# EAGLE design mega_meco_rev3 (EAGLE 9.0.1)
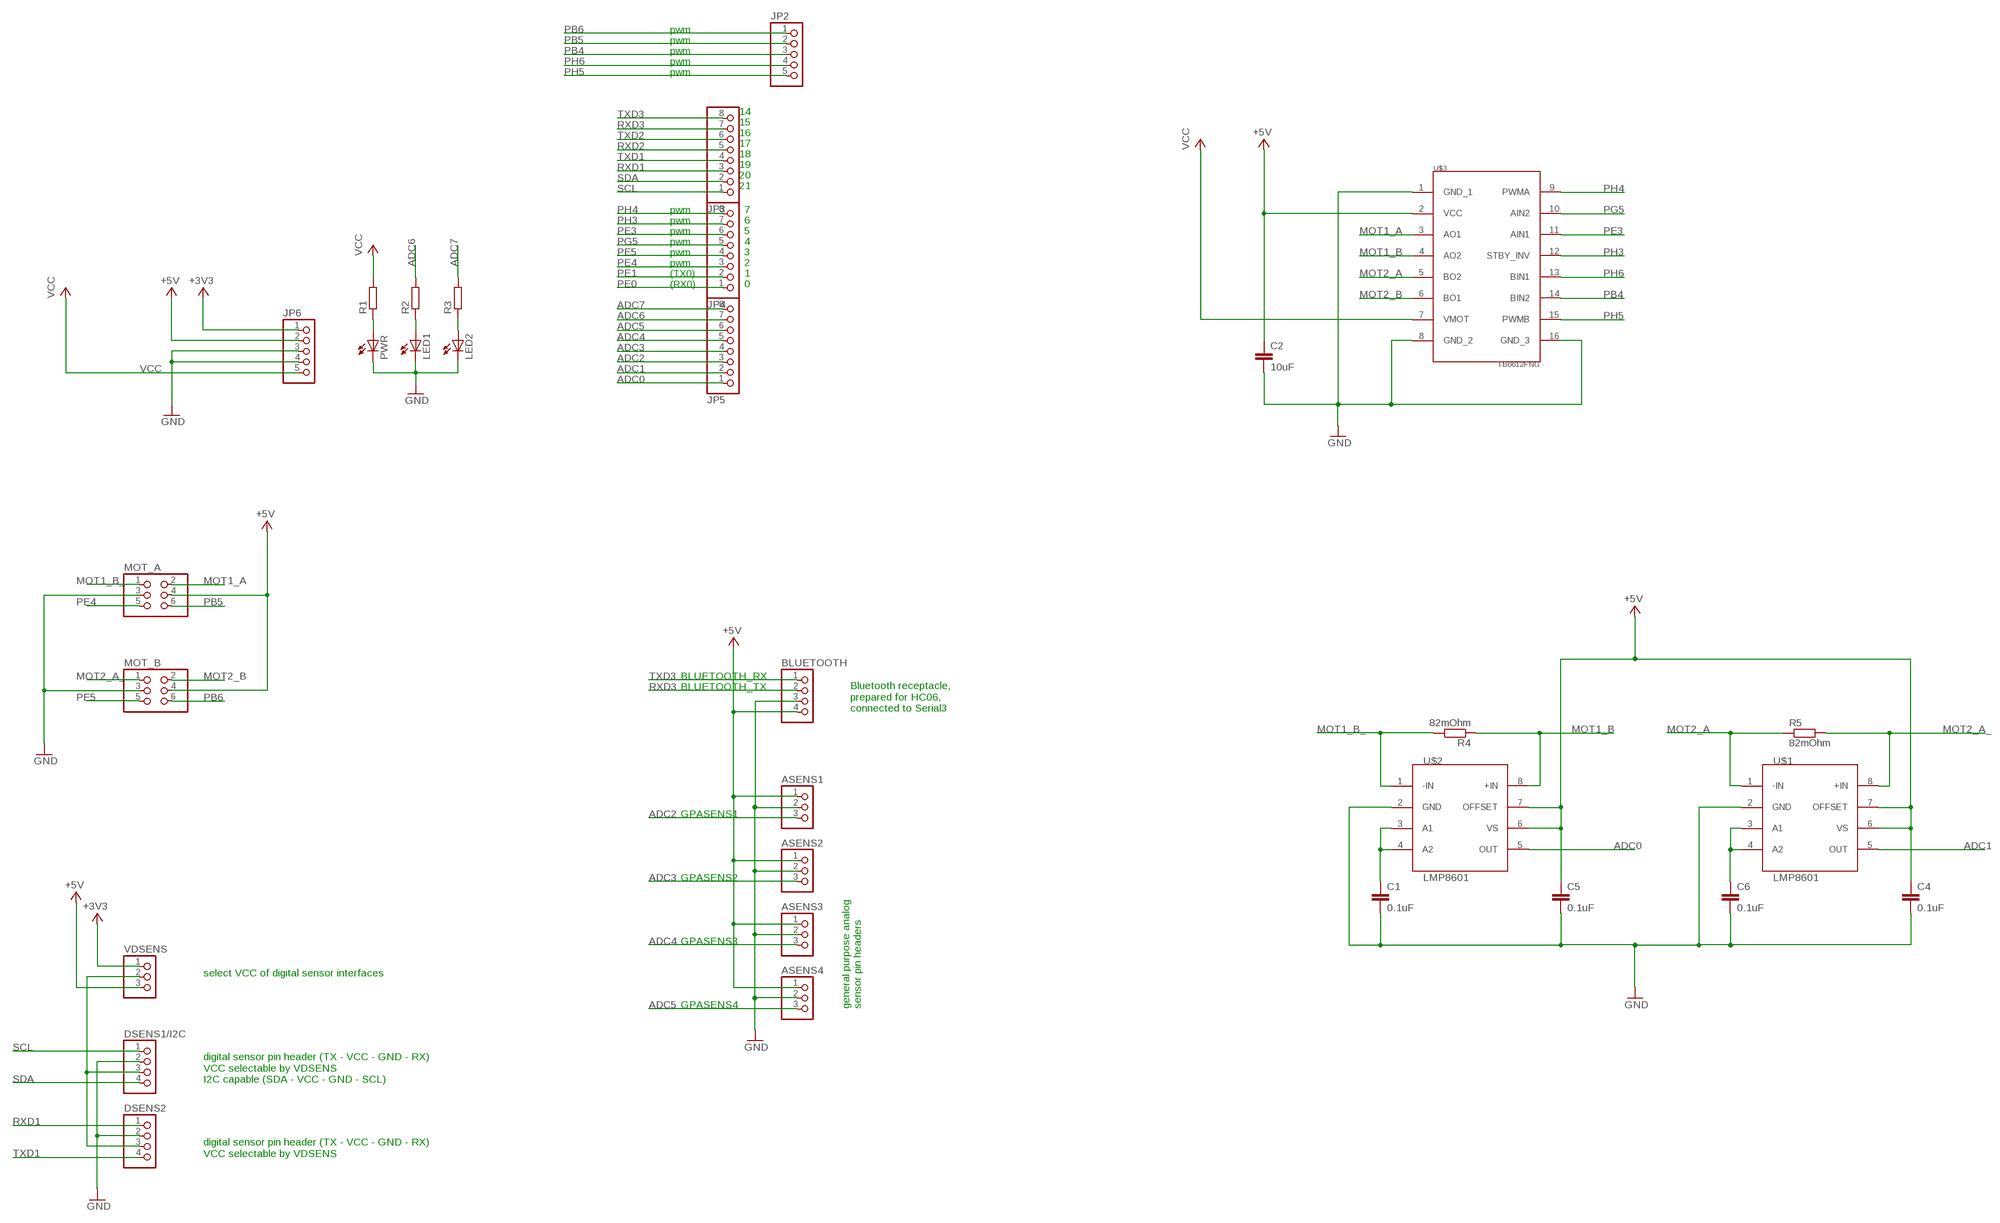
[diagram p0: schematic, sheet 1]

## Parts
ASENS1  PINHD-1X3  [1X03]
ASENS2  PINHD-1X3  [1X03]
ASENS3  PINHD-1X3  [1X03]
ASENS4  PINHD-1X3  [1X03]
BLUETOOTH  PINHD-1X4  [1X04]
C1  0.1uF  C-EUC0805  [C0805]
C2  10uF  C-EUC1206  [C1206]
C4  0.1uF  C-EUC0805  [C0805]
C5  0.1uF  C-EUC0805  [C0805]
C6  0.1uF  C-EUC0805  [C0805]
DSENS1/I2C  PINHD-1X4  [1X04]
DSENS2  PINHD-1X4  [1X04]
JP2  PINHD-1X5  [1X05]
JP3  PINHD-1X8  [1X08]
JP4  PINHD-1X8  [1X08]
JP5  PINHD-1X8  [1X08]
JP6  PINHD-1X5  [1X05]
LED1  LED3MM  [LED3MM]
LED2  LED3MM  [LED3MM]
MOT_A  PINHD-2X3  [2X03]
MOT_B  PINHD-2X3  [2X03]
PWR  LED5MM  [LED5MM]
R1  R-EU_R0805  [R0805]
R2  R-EU_R0805  [R0805]
R3  R-EU_R0805  [R0805]
R4  82mOhm  R-EU_R1206  [R1206]
R5  82mOhm  R-EU_R1206  [R1206]
U$1  LMP8601  [SOIC127P600X175-8N]
U$2  LMP8601  [SOIC127P600X175-8N]
U$3  TB6612FNG  [TB6612FNG_CARRIER]
VDSENS  PINHD-1X3  [1X03]

## Nets
+3V3 [power]: JP6.1 VDSENS.1
+5V [power usb]: ASENS1.1 ASENS2.1 ASENS3.1 ASENS4.1 BLUETOOTH.4 C2.1 C4.1 C5.1 JP6.2 MOT_A.4 MOT_B.4 U$1.6(VS) U$1.7(OFFSET) U$2.6(VS) U$2.7(OFFSET) U$3.2(VCC) VDSENS.3
ADC0: JP5.1 U$2.5(OUT)
ADC1: JP5.2 U$1.5(OUT)
ADC2: ASENS1.3 JP5.3
ADC3: ASENS2.3 JP5.4
ADC4: ASENS3.3 JP5.5
ADC5: ASENS4.3 JP5.6
ADC6: JP5.7 R2.2
ADC7: JP5.8 R3.2
GND [gnd]: ASENS1.2 ASENS2.2 ASENS3.2 ASENS4.2 BLUETOOTH.3 C1.2 C2.2 C4.2 C5.2 C6.2 DSENS1/I2C.2 DSENS2.2 JP6.3 JP6.4 LED1.K(C) LED2.K(C) MOT_A.3 MOT_B.3 PWR.K(C) U$1.2(GND) U$2.2(GND) U$3.1(GND_1) U$3.8(GND_2) U$3.16(GND_3)
MOT1_A: MOT_A.2 U$3.3(AO1)
MOT1_B: R4.1 U$2.8(+IN) U$3.4(AO2)
MOT1_B_: MOT_A.1 R4.2 U$2.1(-IN)
MOT2_A: R5.1 U$1.1(-IN) U$3.5(BO2)
MOT2_A_: MOT_B.1 R5.2 U$1.8(+IN)
MOT2_B: MOT_B.2 U$3.6(BO1)
N$1: PWR.A R1.1
N$2: LED1.A R2.1
N$3: C1.1 U$2.3(A1) U$2.4(A2)
N$4: C6.1 U$1.3(A1) U$1.4(A2)
N$5: DSENS1/I2C.3 DSENS2.3 VDSENS.2
N$6: LED2.A R3.1
PB4: JP2.3 U$3.14(BIN2)
PB5: JP2.2 MOT_A.6
PB6: JP2.1 MOT_B.6
PE0: JP4.1
PE1: JP4.2
PE3: JP4.6 U$3.11(AIN1)
PE4: JP4.3 MOT_A.5
PE5: JP4.4 MOT_B.5
PG5: JP4.5 U$3.10(AIN2)
PH3: JP4.7 U$3.12(STBY_INV)
PH4: JP4.8 U$3.9(PWMA)
PH5: JP2.5 U$3.15(PWMB)
PH6: JP2.4 U$3.13(BIN1)
RXD1: DSENS2.1 JP3.3
RXD2: JP3.5
RXD3: BLUETOOTH.2 JP3.7
SCL: DSENS1/I2C.1 JP3.1
SDA: DSENS1/I2C.4 JP3.2
TXD1: DSENS2.4 JP3.4
TXD2: JP3.6
TXD3: BLUETOOTH.1 JP3.8
VCC [power]: JP6.5 R1.2 U$3.7(VMOT)

## Notes on the sheet
- pwm
- pwm
- pwm
- pwm
- pwm
- 14
- 15
- 16
- 17
- 18
- 19
- 20
- 21
- pwm | 7
- pwm | 6
- pwm | 5
- pwm | 4
- pwm | 3
- pwm | 2
- (TX0) | 1
- (RX0) | 0
- BLUETOOTH_RX
- BLUETOOTH_TX
- Bluetooth receptacle,
  prepared for HC06,
  connected to Serial3
- GPASENS1
- GPASENS2
- GPASENS3
- select VCC of digital sensor interfaces
- GPASENS4
- general purpose analog
  sensor pin headers
- digital sensor pin header (TX - VCC - GND - RX)
  VCC selectable by VDSENS
  I2C capable (SDA - VCC - GND - SCL)
- digital sensor pin header (TX - VCC - GND - RX)
  VCC selectable by VDSENS

## Library data of the parts
ASENS1-ASENS4 VDSENS = pinhead:PINHD-1X3: PIN HEADER
BLUETOOTH DSENS1/I2C DSENS2 = pinhead:PINHD-1X4: PIN HEADER
C1 C2 C4-C6 = rcl:C-EU: CAPACITOR, European symbol; SPICEPREFIX: C
JP2 JP6 = pinhead:PINHD-1X5: PIN HEADER
JP3-JP5 = pinhead:PINHD-1X8: PIN HEADER
LED1 LED2 PWR = led:LED: LED OSRAM: - CHIPLED LG R971, LG N971, LY N971, LG Q971, LY Q971, LO R971, LY R971 LH N974, LH R974 LS Q976, LO Q976, LY Q976 LO Q996 - Hyper CHIPLED LW Q18S LB Q993, LB Q99A, LB R99A - SideLED LS A670, LO A670, LY A670, LG A670, LP A670 LB A673, LV A673, LT A673, LW A673 LH A674 LY A675 LS A676, LA A676, LO A676, LY A676, LW A676 LS A679, LY A679, LG A679 - Hyper Micro SIDELED® LS Y876, LA Y876, LO Y876, LY Y876 LT Y87S - SmartLED LW L88C, LW L88S LB L89C, LB L89S, LG L890 LS L89K, LO L89K, LY L89K LS L896, LA L896, LO L896, LY L896 - TOPLED LS T670, LO T670, LY T670, LG T670, LP T670 LSG T670, LSP T670, LSY T670, LOP T670, LYG T670 LG T671, LOG T671, LSG T671 LB T673, LV T673, LT T673, LW T673 LH T674 LS T676, LA T676, LO T676, LY T676, LB T676, LH T676, LSB T676, LW T676 LB T67C, LV T67C, LT T67C, LS T67K, LO T67K, LY T67K, LW E67C LS E67B, LA E67B, LO E67B, LY E67B, LB E67C, LV E67C, LT E67C LW T67C LS T679, LY T679, LG T679 LS T770, LO T770, LY T770, LG T770, LP T770 LB T773, LV T773, LT T773, LW T773 LH T774 LS E675, LA E675, LY E675, LS T675 LS T776, LA T776, LO T776, LY T776, LB T776 LHGB T686 LT T68C, LB T68C - Hyper Mini TOPLED® LB M676 - Mini TOPLED Santana® LG M470 LS M47K, LO M47K, LY M47K Source: http://www.osram.convergy.de LUXEON: - LUMILED® LXK2-PW12-R00, LXK2-PW12-S00, LXK2-PW14-U00, LXK2-PW14-V00 LXK2-PM12-R00, LXK2-PM12-S00, LXK2-PM14-U00 LXK2-PE12-Q00, LXK2-PE12-R00, LXK2-PE12-S00, LXK2-PE14-T00, LXK2-PE14-U00 LXK2-PB12-K00, LXK2-PB12-L00, LXK2-PB12-M00, LXK2-PB14-N00, LXK2-PB14-P00, LXK2-PB14-Q00 LXK2-PR12-L00, LXK2-PR12-M00, LXK2-PR14-Q00, LXK2-PR14-R00 LXK2-PD12-Q00, LXK2-PD12-R00, LXK2-PD12-S00 LXK2-PH12-R00, LXK2-PH12-S00 LXK2-PL12-P00, LXK2-PL12-Q00, LXK2-PL12-R00 Source: www.luxeon.com KINGBRIGHT: KA-3528ASYC Source: www.kingbright.com
MOT_A MOT_B = pinhead:PINHD-2X3: PIN HEADER
R1 R4 R5 = rcl:R-EU_: RESISTOR, European symbol; SPICEPREFIX: R
R2 R3 = resistor:R-EU_: RESISTOR, European symbol
U$1 U$2 = Texas Instruments_By_element14_Batch_1:LMP8601
U$3 = pololu_tb6612fng:TB6612FNG

## Module DSENS
Ports: 
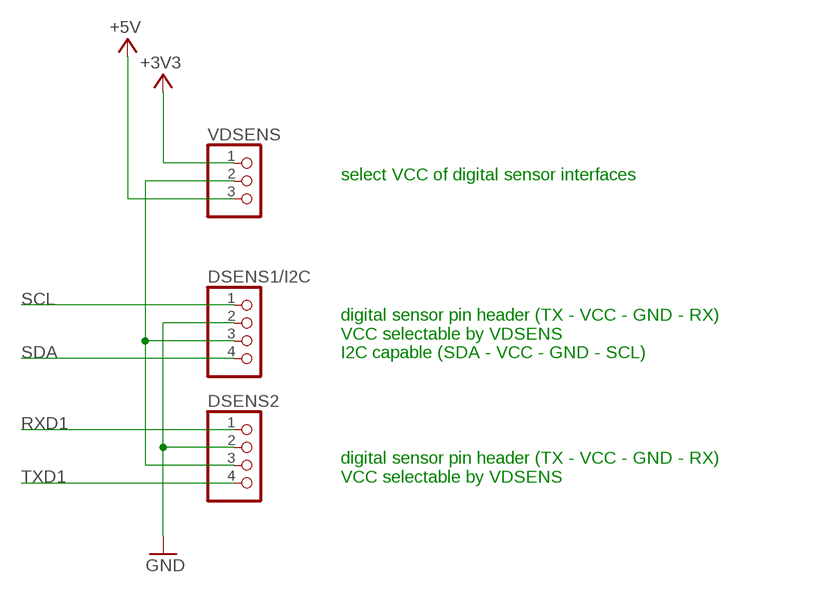
[diagram p1: schematic, module DSENS, sheet 1]

### Parts
DSENS1/I2C  PINHD-1X4  [1X04]
DSENS2  PINHD-1X4  [1X04]
VDSENS  PINHD-1X3  [1X03]

### Nets
+3V3 [power]: VDSENS.1
+5V [power usb]: VDSENS.3
GND [gnd]: DSENS1/I2C.2 DSENS2.2
N$5: DSENS1/I2C.3 DSENS2.3 VDSENS.2
RXD1: DSENS2.1
SCL: DSENS1/I2C.1
SDA: DSENS1/I2C.4
TXD1: DSENS2.4

### Notes on the sheet
- select VCC of digital sensor interfaces
- digital sensor pin header (TX - VCC - GND - RX)
  VCC selectable by VDSENS
  I2C capable (SDA - VCC - GND - SCL)
- digital sensor pin header (TX - VCC - GND - RX)
  VCC selectable by VDSENS

### Library data of the parts
DSENS1/I2C DSENS2 = pinhead:PINHD-1X4: PIN HEADER
VDSENS = pinhead:PINHD-1X3: PIN HEADER

## Net classes
0 default: width 0.203 mm, drill 0.406 mm, clearance 0.203 mm
1 power: width 0.61 mm, drill 0.406 mm, clearance 0.203 mm
2 gnd: width 0.305 mm, drill 0.406 mm, clearance 0.203 mm
3 power usb: width 0.508 mm, drill 0.406 mm, clearance 0.203 mm

## Board
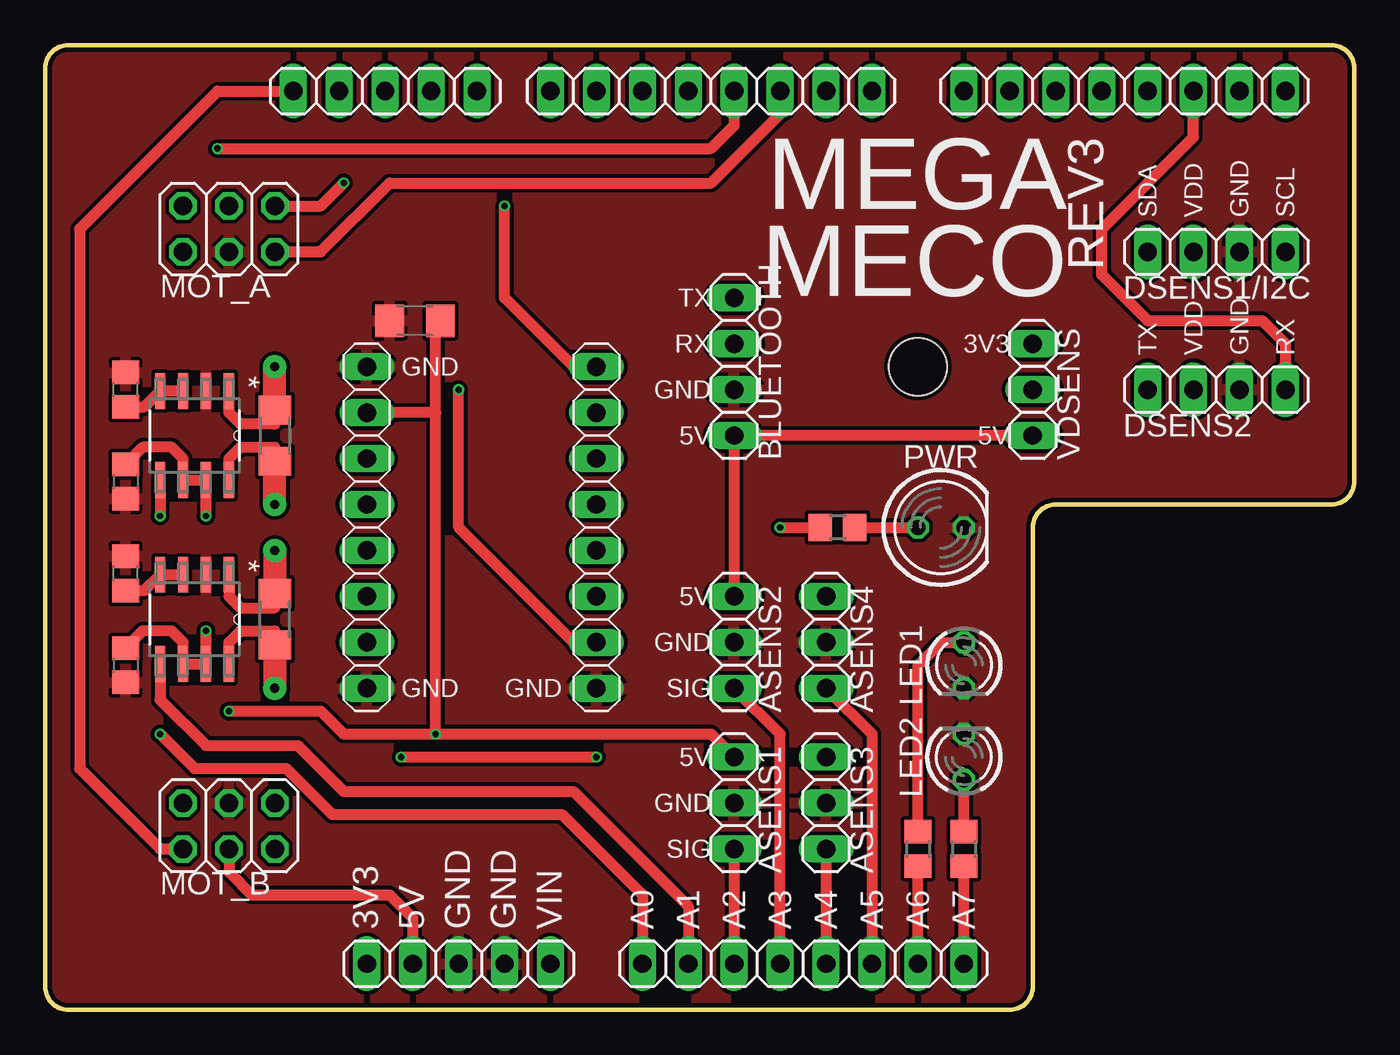
[diagram p2: board, top side]
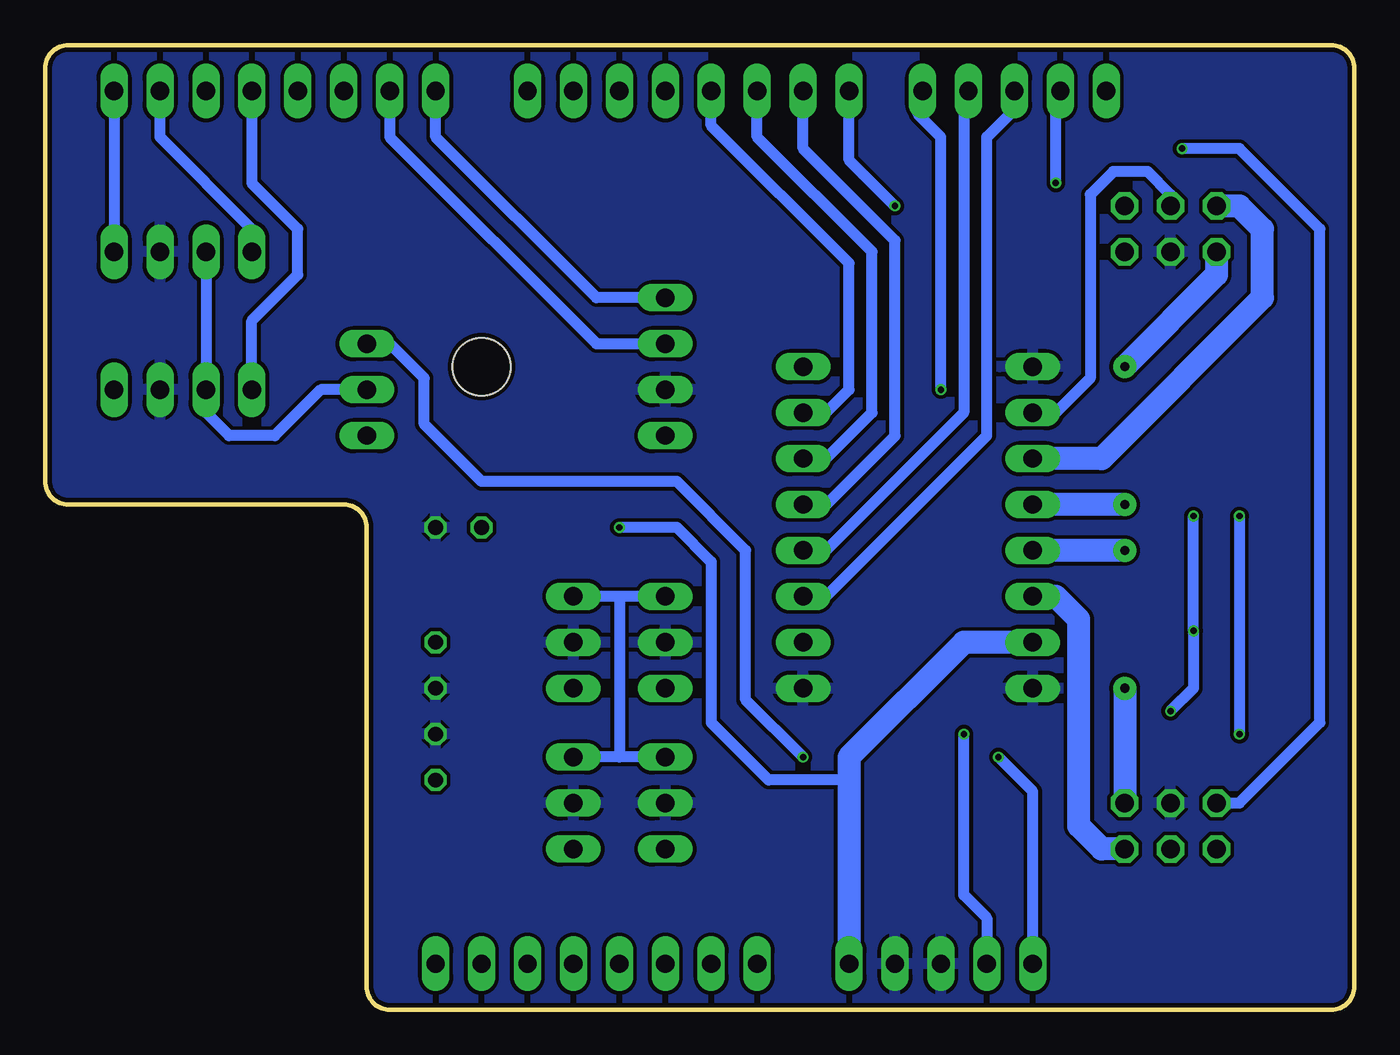
[diagram p3: board, bottom side, seen from below]

Size 72.39 x 53.34 mm. Coordinates in mm from the lower left corner, seen from the top.
Outline: 71.12,53.34 arc-90 72.39,52.07 72.39,29.21 arc-90 71.12,27.94 55.88,27.94 arc90 54.61,26.67 54.61,1.27 arc-90 53.34,0 1.27,0 arc-90 0,1.27 0,52.07 arc-90 1.27,53.34 71.12,53.34
Copper layers (1*16): Top 0.018mm / dielectric 1.55mm / Bottom 0.018mm
Design rules "eC_2Layer_PClass6_BaseCopperO18_eCDefault": minimum track width 0.15mm, minimum drill 0.35mm, track to track 0.15mm, track to pad 0.15mm, pad to pad 0.15mm, via to via 0.15mm, smd to smd 0mil, copper to edge 0.25mm, drill to drill 0.35mm, minimum pad ring 0.175mm, minimum via ring 0.125mm, stop-mask expansion 0mil, vias tented up to drill 0.45mm, thermal gap 0.2mm
Holes 3.2 mm at 48.26,35.56

### Footprints (pad centres in the part's own frame; a part is rotated, then mirrored left to right if it is on the bottom)
1X03 = drill 1.016 long: 1 -2.54,0; 2 0,0; 3 2.54,0
1X04 = drill 1.016 long: 1 -3.81,0; 2 -1.27,0; 3 1.27,0; 4 3.81,0
C0805 = smd 1.3 x 1.5: 1 -0.95,0; 2 0.95,0
C1206 = smd 1.6 x 1.8: 1 -1.4,0; 2 1.4,0
1X05 = drill 1.016 long: 1 -5.08,0; 2 -2.54,0; 3 0,0; 4 2.54,0; 5 5.08,0
1X08 = drill 1.016 long: 1 -8.89,0; 2 -6.35,0; 3 -3.81,0; 4 -1.27,0; 5 1.27,0; 6 3.81,0; 7 6.35,0; 8 8.89,0
LED3MM = drill 0.813 octagon: A -1.27,0; K 1.27,0
2X03 = drill 1.016 octagon: 1 -2.54,-1.27; 2 -2.54,1.27; 3 0,-1.27; 4 0,1.27; 5 2.54,-1.27; 6 2.54,1.27
LED5MM = drill 0.813 octagon: A -1.27,0; K 1.27,0
R0805 = smd 1.3 x 1.5: 1 -0.95,0; 2 0.95,0
R1206 = smd 1.6 x 1.803: 1 -1.422,0; 2 1.422,0
SOIC127P600X175-8N = smd 1.981 x 0.559: 1 -2.464,1.905; 2 -2.464,0.635; 3 -2.464,-0.635; 4 -2.464,-1.905; 5 2.464,-1.905; 6 2.464,-0.635; 7 2.464,0.635; 8 2.464,1.905
TB6612FNG_CARRIER = drill 1.016 long: 1 -6.35,8.89; 2 -6.35,6.35; 3 -6.35,3.81; 4 -6.35,1.27; 5 -6.35,-1.27; 6 -6.35,-3.81; 7 -6.35,-6.35; 8 -6.35,-8.89; 9 6.35,8.89; 10 6.35,6.35; 11 6.35,3.81; 12 6.35,1.27; 13 6.35,-1.27; 14 6.35,-3.81; 15 6.35,-6.35; 16 6.35,-8.89

### Placement (x,y rotation side)
ASENS1  38.1,11.43 270 top
ASENS2  38.1,20.32 270 top
ASENS3  43.18,11.43 270 top
ASENS4  43.18,20.32 270 top
BLUETOOTH  38.1,35.56 270 top
C1  4.45,34.29 90 top
C2  20.45,38.1 180 top
C4  4.45,19.05 270 top
C5  4.45,29.21 270 top
C6  4.45,24.13 90 top
DSENS1/I2C  64.77,41.91 180 top
DSENS2  64.77,34.29 180 top
JP2  18.8,50.8 0 top
JP3  59.69,50.8 180 top
JP4  36.83,50.8 180 top
JP5  41.91,2.54 0 top
JP6  22.86,2.54 0 top
LED1  50.8,19.05 270 top
LED2  50.8,13.97 90 top
MOT_A  10.16,43.18 0 top
MOT_B  10.16,10.16 180 top
PWR  49.53,26.67 0 top
R1  43.81,26.67 180 top
R2  48.26,8.89 270 top
R3  50.8,8.89 270 top
R4  12.7,31.75 90 top
R5  12.7,21.59 270 top
U$1  8.26,21.59 270 top
U$2  8.26,31.75 270 top
U$3  24.13,26.67 0 top
VDSENS  54.61,34.29 270 top

### Tracks (layer width: path | path; a pad name or v marks a point on that pad's centre or on a via)
+3V3  (via drill 0.35)
  Top 0.61: v19.68,13.97 v30.48,13.97
  Bottom 0.61: v30.48,13.97 33.66,17.14 33.66,25.4 37.47,29.21 48.26,29.21 51.44,32.38 51.44,34.92 53.34,36.83 VDSENS.1 | JP6.1 17.78,12.06 v19.68,13.97
+5V  (via drill 0.35)
  Top 0.61: C5.1 5.4,31.11 6.99,31.11 7.62,30.48 U$2.6 U$2.7 v8.89,27.3 | C4.1 5.4,20.95 6.99,20.95 7.62,20.32 U$1.6 U$1.7 v8.89,20.95 | MOT_B.4 10.16,7.62 11.43,6.35 19.05,6.35 20.32,5.08 JP6.2 | v21.59,15.24 21.59,33.02 | 21.59,33.02 U$3.2 | v10.16,16.51 15.24,16.51 16.51,15.24 v21.59,15.24 | v21.59,15.24 36.83,15.24 ASENS1.1 | 21.59,33.02 21.59,37.84 C2.1 | VDSENS.3 BLUETOOTH.4 ASENS2.1
  Bottom 0.61: ASENS2.1 40.64,22.86 | 40.64,22.86 ASENS4.1 | ASENS1.1 40.64,13.97 | 40.64,13.97 ASENS3.1 | v8.89,27.3 v8.89,20.95 8.89,17.78 v10.16,16.51 | MOT_A.4 10.16,45.09 11.43,46.35 13.34,46.35 14.61,45.09 14.61,34.92 16.51,33.02 U$3.2 | JP6.2 20.32,5.08 21.59,6.35 v21.59,15.24 | 40.64,22.86 40.64,13.97
ADC0  (via drill 0.35)
  Top 0.61: U$2.5 v6.35,27.3 | v6.35,15.24 8.26,13.34 13.34,13.34 15.88,10.79 28.57,10.79 33.02,6.35 JP5.1
  Bottom 0.61: v6.35,27.3 v6.35,15.24
ADC1
  Top 0.61: U$1.5 6.35,17.14 8.89,14.61 13.97,14.61 16.51,12.06 29.21,12.06 35.56,5.71 JP5.2
ADC2
  Top 0.61: ASENS1.3 JP5.3
ADC3
  Top 0.61: JP5.4 40.64,15.24 ASENS2.3
ADC4
  Top 0.61: ASENS3.3 JP5.5
ADC5
  Top 0.61: ASENS4.3 45.72,15.24 JP5.6
ADC6
  Top 0.61: JP5.7 R2.2
ADC7
  Top 0.61: JP5.8 R3.2
GND
  pour Bottom: -2.54,55.88 -2.54,-2.54 74.93,-2.54 74.93,55.88
  pour Top: -5.08,-5.08 77.47,-5.08 77.47,58.42 -5.08,58.42
MOT1_A
  Bottom 1.27: U$3.3 13.97,30.48 5.08,39.37 5.08,43.18 6.35,44.45 MOT_A.2
MOT1_B  (via drill 0.5 pad 1.27)
  Top 0.61: R4.1 12.7,31.11 10.79,31.11 10.16,30.48 U$2.8
  Top 1.27: v12.7,27.94 R4.1
  Bottom 1.27: v12.7,27.94 U$3.4
MOT1_B_  (via drill 0.5 pad 1.27)
  Top 0.61: R4.2 12.7,32.38 10.79,32.38 10.16,33.02 U$2.1
  Top 1.27: R4.2 v12.7,35.56
  Bottom 1.27: MOT_A.1 7.62,40.64 v12.7,35.56
MOT2_A  (via drill 0.5 pad 1.27)
  Top 0.61: U$1.1 10.16,22.86 10.79,22.23 12.7,22.23 R5.1
  Top 1.27: v12.7,25.4 R5.1
  Bottom 1.27: v12.7,25.4 U$3.5
MOT2_A_  (via drill 0.5 pad 1.27)
  Top 0.61: U$1.8 10.16,20.32 10.79,20.95 12.7,20.95 R5.2
  Top 1.27: R5.2 v12.7,17.78
  Bottom 1.27: v12.7,17.78 MOT_B.1
MOT2_B
  Bottom 1.27: U$3.6 16.51,22.86 15.24,21.59 15.24,10.16 13.97,8.89 MOT_B.2
N$1
  Top 0.61: R1.1 PWR.A
N$2
  Top 0.61: LED1.A 49.53,20.32 48.26,19.05 R2.1
N$3
  Top 0.61: U$2.3 U$2.4 5.48,33.34 C1.1 4.84,33.34
N$4
  Top 0.61: U$1.3 U$1.4 5.48,23.18 C6.1
N$5
  Bottom 0.61: DSENS1/I2C.3 DSENS2.3 63.5,33.02 62.23,31.75 59.69,31.75 57.15,34.29 VDSENS.2
N$6
  Top 0.61: R3.1 LED2.A
PB4
  Bottom 0.61: JP2.3 19.05,50.55 19.05,49.53 20.32,48.26 20.32,31.75 29.21,22.86 U$3.14
PB5  (via drill 0.35)
  Top 0.61: MOT_A.6 15.24,44.45 v16.51,45.72
  Bottom 0.61: JP2.2 16.51,50.55 v16.51,45.72
PB6
  Top 0.61: MOT_B.6 6.35,8.89 1.91,13.34 1.91,43.18 9.53,50.8 JP2.1
PE3
  Bottom 0.61: U$3.11 29.21,30.48 26.67,33.02 26.67,41.91 33.02,48.26 JP4.6
PE4
  Top 0.61: JP4.3 40.64,49.53 36.83,45.72 19.05,45.72 15.24,41.91 MOT_A.5
PE5  (via drill 0.35)
  Top 0.61: JP4.4 38.1,48.9 36.83,47.62 v9.53,47.62
  Bottom 0.61: MOT_B.5 6.35,11.43 1.91,15.88 1.91,43.18 6.35,47.62 v9.53,47.62
PG5
  Bottom 0.61: U$3.10 29.21,33.02 27.94,34.29 27.94,41.27 35.56,48.9 JP4.5
PH3
  Bottom 0.61: U$3.12 29.19,27.94 25.4,31.73 25.4,42.55 30.48,47.62 JP4.7
PH4  (via drill 0.35)
  Top 0.61: U$3.9 29.21,35.56 25.4,39.37 v25.4,44.45
  Bottom 0.61: v25.4,44.45 27.94,46.99 JP4.8
PH5  (via drill 0.35)
  Top 0.61: v22.86,34.29 22.86,26.67 29.21,20.32 U$3.15
  Bottom 0.61: v22.86,34.29 22.86,48.26 24.13,49.53 24.13,50.8 JP2.5
PH6
  Bottom 0.61: JP2.4 21.59,50.55 21.59,33.02 29.21,25.4 U$3.13
RXD1
  Top 0.61: JP3.3 63.5,48.26 58.42,43.18 58.42,40.64 60.96,38.1 67.31,38.1 68.58,36.83 DSENS2.1
RXD3
  Bottom 0.61: JP3.7 53.34,48.26 41.91,36.83 BLUETOOTH.2
SCL
  Bottom 0.61: JP3.1 DSENS1/I2C.1
SDA
  Bottom 0.61: JP3.2 66.04,48.26 60.96,43.18 DSENS1/I2C.4
TXD1
  Bottom 0.61: JP3.4 60.96,45.72 58.42,43.18 58.42,40.64 60.96,38.1 DSENS2.4
TXD3
  Bottom 0.61: JP3.8 50.8,48.26 41.91,39.37 BLUETOOTH.1
VCC  (via drill 0.35)
  Top 0.61: v40.64,26.67 R1.2
  Bottom 0.61: 27.94,12.7 32.38,12.7 35.56,15.88 35.56,24.77 37.47,26.67 v40.64,26.67
  Bottom 1.27: U$3.7 21.59,20.32 27.94,13.97 27.94,12.7 JP6.5

### Text on the board
tPlace: MEGA / MECO | REV3
tNames: SDA | VDD | GND | SCL | TX | RX | 3V3 | GND | TX | VDD | GND | RX | GND | 5V | 5V | 5V | GND | GND | GND | SIG | 5V | GND | SIG | 3V3 | 5V | GND | GND | VIN | A0 | A1 | A2 | A3 | A4 | A5 | A6 | A7